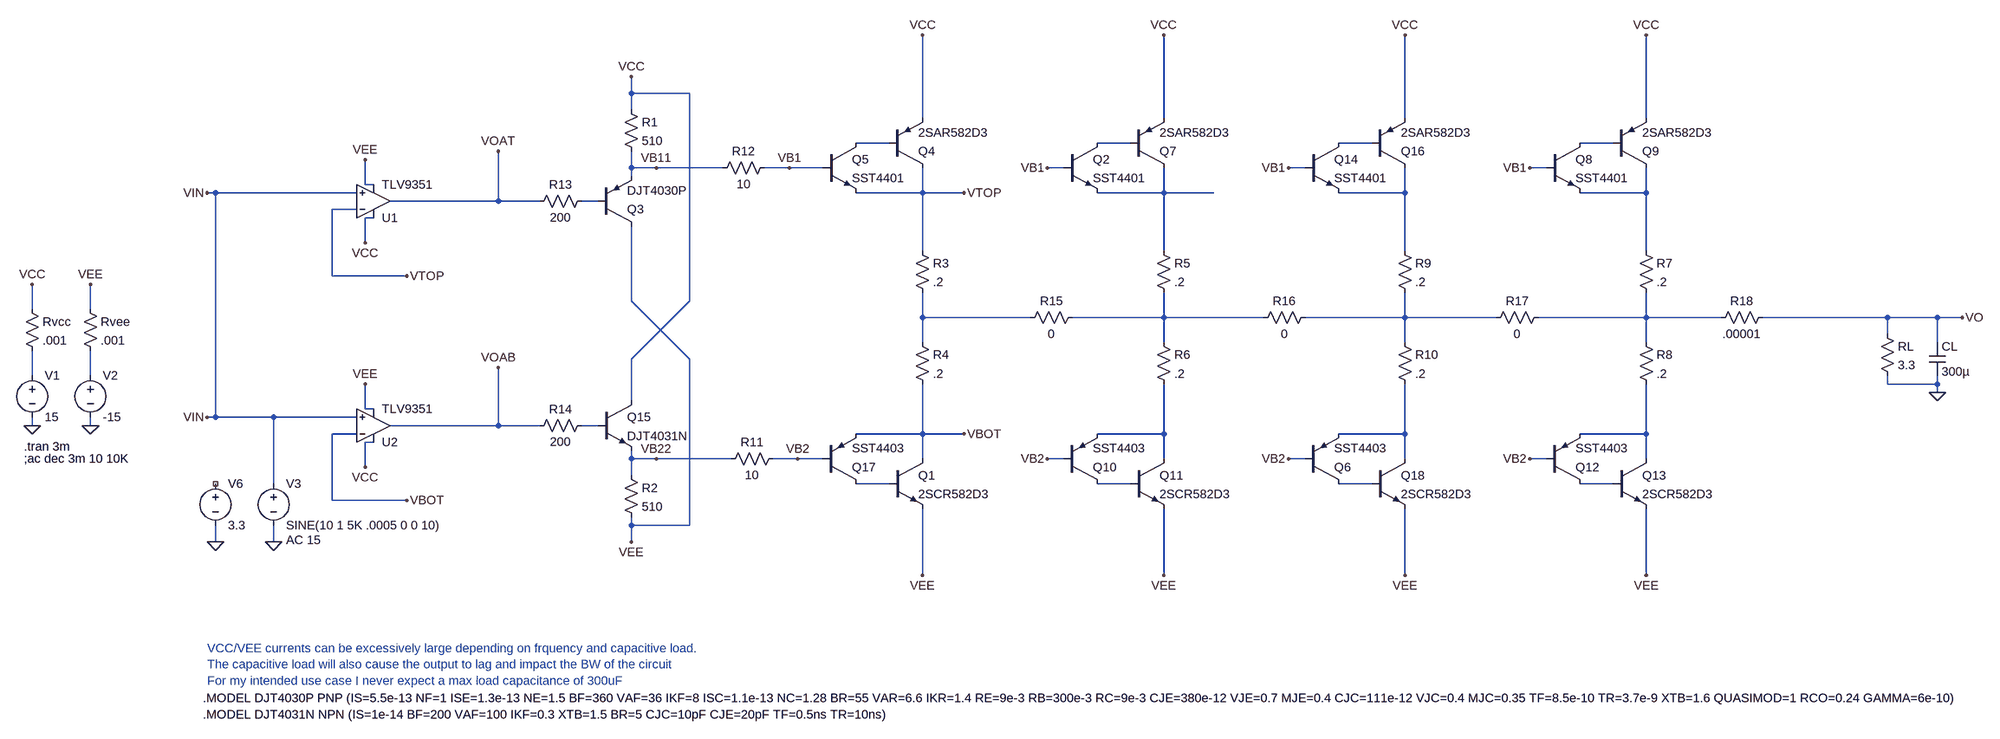
[diagram p0: schematic NOT_USED_Current Amplifier-1_REV_22.asc]
NOT_USED_Current Amplifier-1_REV_22.asc, the LTspice schematic file:
Version 4
SHEET 1 3356 1336
WIRE 80 -128 80 -160
WIRE 192 -128 80 -128
WIRE 80 -96 80 -128
WIRE 640 -80 640 -240
WIRE 1104 -80 1104 -240
WIRE 1568 -80 1568 -240
WIRE 2032 -80 2032 -240
WIRE 576 -32 512 -32
WIRE 1040 -32 976 -32
WIRE 1504 -32 1440 -32
WIRE 1968 -32 1904 -32
WIRE 80 16 80 -16
WIRE 128 16 80 16
WIRE 256 16 128 16
WIRE 384 16 336 16
WIRE 448 16 384 16
WIRE 912 16 880 16
WIRE 1376 16 1344 16
WIRE 1840 16 1808 16
WIRE 80 32 80 16
WIRE -432 48 -432 0
WIRE -416 48 -432 48
WIRE -720 64 -736 64
WIRE -448 64 -720 64
WIRE 640 64 640 16
WIRE 640 64 512 64
WIRE 720 64 640 64
WIRE 1104 64 1104 16
WIRE 1104 64 976 64
WIRE 1200 64 1104 64
WIRE 1568 64 1568 16
WIRE 1568 64 1440 64
WIRE 2032 64 2032 16
WIRE 2032 64 1904 64
WIRE -176 80 -176 -16
WIRE -176 80 -384 80
WIRE -96 80 -176 80
WIRE 16 80 -16 80
WIRE -448 96 -496 96
WIRE -416 112 -432 112
WIRE -432 160 -432 112
WIRE 640 176 640 64
WIRE 1104 176 1104 64
WIRE 1568 176 1568 64
WIRE 2032 176 2032 64
WIRE -496 224 -496 96
WIRE -352 224 -496 224
WIRE 80 272 80 128
WIRE 192 272 192 -128
WIRE -1424 288 -1424 240
WIRE -1312 288 -1312 240
WIRE 640 304 640 256
WIRE 848 304 640 304
WIRE 1104 304 1104 256
WIRE 1104 304 928 304
WIRE 1296 304 1104 304
WIRE 1568 304 1568 256
WIRE 1568 304 1376 304
WIRE 1744 304 1568 304
WIRE 2032 304 2032 256
WIRE 2032 304 1824 304
WIRE 2176 304 2032 304
WIRE 2496 304 2256 304
WIRE 2592 304 2496 304
WIRE 2640 304 2592 304
WIRE 2496 336 2496 304
WIRE 640 352 640 304
WIRE 1104 352 1104 304
WIRE 1568 352 1568 304
WIRE 2032 352 2032 304
WIRE 2592 352 2592 304
WIRE 80 384 192 272
WIRE 192 384 80 272
WIRE -1424 416 -1424 368
WIRE -1312 416 -1312 368
WIRE 2496 432 2496 416
WIRE 2592 432 2592 416
WIRE 2592 432 2496 432
WIRE 2592 448 2592 432
WIRE 80 464 80 384
WIRE -432 480 -432 432
WIRE -416 480 -432 480
WIRE -720 496 -720 64
WIRE -720 496 -736 496
WIRE -608 496 -720 496
WIRE -448 496 -608 496
WIRE -1424 512 -1424 496
WIRE -1312 512 -1312 496
WIRE -176 512 -176 400
WIRE -176 512 -384 512
WIRE -96 512 -176 512
WIRE 16 512 -16 512
WIRE -448 528 -496 528
WIRE 640 528 640 432
WIRE 640 528 512 528
WIRE 720 528 640 528
WIRE 1104 528 1104 432
WIRE 1104 528 976 528
WIRE 1568 528 1568 432
WIRE 1568 528 1440 528
WIRE 2032 528 2032 432
WIRE 2032 528 1904 528
WIRE -416 544 -432 544
WIRE 80 576 80 560
WIRE 128 576 80 576
WIRE 272 576 128 576
WIRE 400 576 352 576
WIRE 448 576 400 576
WIRE 640 576 640 528
WIRE 912 576 880 576
WIRE 1104 576 1104 528
WIRE 1376 576 1344 576
WIRE 1568 576 1568 528
WIRE 1840 576 1808 576
WIRE 2032 576 2032 528
WIRE -432 592 -432 544
WIRE 80 608 80 576
WIRE -608 624 -608 496
WIRE 576 624 512 624
WIRE 1040 624 976 624
WIRE 1504 624 1440 624
WIRE 1968 624 1904 624
WIRE -496 656 -496 528
WIRE -352 656 -496 656
WIRE 80 704 80 688
WIRE 192 704 192 384
WIRE 192 704 80 704
WIRE -720 736 -720 704
WIRE -608 736 -608 704
WIRE 80 736 80 704
WIRE 640 800 640 672
WIRE 1104 800 1104 672
WIRE 1568 800 1568 672
WIRE 2032 800 2032 672
FLAG -1424 240 VCC
FLAG -1312 240 VEE
FLAG -1424 512 0
FLAG -1312 512 0
FLAG 640 -240 VCC
FLAG 640 800 VEE
FLAG -432 160 VCC
FLAG -432 0 VEE
FLAG 2592 448 0
FLAG 2640 304 VO
FLAG -736 64 VIN
FLAG 80 -160 VCC
FLAG 80 736 VEE
FLAG 1104 -240 VCC
FLAG 1104 800 VEE
FLAG 384 16 VB1
FLAG 400 576 VB2
FLAG 880 16 VB1
FLAG 880 576 VB2
FLAG 2032 -240 VCC
FLAG 2032 800 VEE
FLAG 1808 16 VB1
FLAG 1808 576 VB2
FLAG 1568 -240 VCC
FLAG 1568 800 VEE
FLAG 1344 16 VB1
FLAG 1344 576 VB2
FLAG 128 16 VB11
FLAG 128 576 VB22
FLAG 720 64 VTOP
FLAG 720 528 VBOT
FLAG -432 592 VCC
FLAG -432 432 VEE
FLAG -608 736 0
FLAG -736 496 VIN
FLAG -720 736 0
FLAG -352 224 VTOP
FLAG -352 656 VBOT
FLAG -176 -16 VOAT
FLAG -176 400 VOAB
SYMBOL voltage -1424 400 R0
WINDOW 123 0 0 Left 0
WINDOW 39 0 0 Left 0
SYMATTR InstName V1
SYMATTR Value 15
SYMBOL voltage -1312 400 R0
WINDOW 123 0 0 Left 0
WINDOW 39 0 0 Left 0
SYMATTR InstName V2
SYMATTR Value -15
SYMBOL res 624 160 R0
SYMATTR InstName R3
SYMATTR Value .2
SYMBOL res 624 336 R0
SYMATTR InstName R4
SYMATTR Value .2
SYMBOL res 2480 320 R0
SYMATTR InstName RL
SYMATTR Value 3.3
SYMBOL cap 2576 352 R0
SYMATTR InstName CL
SYMATTR Value 300µ
SYMBOL res 64 -112 R0
SYMATTR InstName R1
SYMATTR Value 510
SYMBOL res 64 592 R0
SYMATTR InstName R2
SYMATTR Value 510
SYMBOL res 1088 160 R0
SYMATTR InstName R5
SYMATTR Value .2
SYMBOL res 1088 336 R0
SYMATTR InstName R6
SYMATTR Value .2
SYMBOL res 2016 160 R0
SYMATTR InstName R7
SYMATTR Value .2
SYMBOL res 2016 336 R0
SYMATTR InstName R8
SYMATTR Value .2
SYMBOL npn 448 -32 R0
SYMATTR InstName Q5
SYMATTR Value SST4401
SYMBOL pnp 576 16 M180
SYMATTR InstName Q4
SYMATTR Value 2SAR582D3
SYMBOL npn 576 576 R0
SYMATTR InstName Q1
SYMATTR Value 2SCR582D3
SYMBOL npn 912 -32 R0
SYMATTR InstName Q2
SYMATTR Value SST4401
SYMBOL pnp 1040 16 M180
SYMATTR InstName Q7
SYMATTR Value 2SAR582D3
SYMBOL npn 1840 -32 R0
SYMATTR InstName Q8
SYMATTR Value SST4401
SYMBOL pnp 1968 16 M180
SYMATTR InstName Q9
SYMATTR Value 2SAR582D3
SYMBOL npn 1040 576 R0
SYMATTR InstName Q11
SYMATTR Value 2SCR582D3
SYMBOL pnp 1840 624 M180
SYMATTR InstName Q12
SYMATTR Value SST4403
SYMBOL npn 1968 576 R0
SYMATTR InstName Q13
SYMATTR Value 2SCR582D3
SYMBOL res 1552 160 R0
SYMATTR InstName R9
SYMATTR Value .2
SYMBOL res 1552 336 R0
SYMATTR InstName R10
SYMATTR Value .2
SYMBOL npn 1376 -32 R0
SYMATTR InstName Q14
SYMATTR Value SST4401
SYMBOL pnp 1504 16 M180
SYMATTR InstName Q16
SYMATTR Value 2SAR582D3
SYMBOL npn 1504 576 R0
SYMATTR InstName Q18
SYMATTR Value 2SCR582D3
SYMBOL res 368 560 R90
WINDOW 0 0 56 VBottom 2
WINDOW 3 32 56 VTop 2
SYMATTR InstName R11
SYMATTR Value 10
SYMBOL res 352 0 R90
WINDOW 0 0 56 VBottom 2
WINDOW 3 32 56 VTop 2
SYMATTR InstName R12
SYMATTR Value 10
SYMBOL Hab_OpAmp\\TLV9351 -416 144 M180
SYMATTR InstName U1
SYMBOL res 0 64 R90
WINDOW 0 0 56 VBottom 2
WINDOW 3 32 56 VTop 2
SYMATTR InstName R13
SYMATTR Value 200
SYMBOL res 0 496 R90
WINDOW 0 0 56 VBottom 2
WINDOW 3 32 56 VTop 2
SYMATTR InstName R14
SYMATTR Value 200
SYMBOL npn 16 464 R0
SYMATTR InstName Q15
SYMATTR Value DJT4031N
SYMBOL pnp 16 128 M180
SYMATTR InstName Q3
SYMATTR Value DJT4030P
SYMBOL res -1440 272 R0
SYMATTR InstName Rvcc
SYMATTR Value .001
SYMBOL res -1328 272 R0
SYMATTR InstName Rvee
SYMATTR Value .001
SYMBOL res 944 288 R90
WINDOW 0 0 56 VBottom 2
WINDOW 3 32 56 VTop 2
SYMATTR InstName R15
SYMATTR Value 0
SYMBOL res 1392 288 R90
WINDOW 0 0 56 VBottom 2
WINDOW 3 32 56 VTop 2
SYMATTR InstName R16
SYMATTR Value 0
SYMBOL res 1840 288 R90
WINDOW 0 0 56 VBottom 2
WINDOW 3 32 56 VTop 2
SYMATTR InstName R17
SYMATTR Value 0
SYMBOL res 2272 288 R90
WINDOW 0 0 56 VBottom 2
WINDOW 3 32 56 VTop 2
SYMATTR InstName R18
SYMATTR Value .00001
SYMBOL pnp 1376 624 M180
SYMATTR InstName Q6
SYMATTR Value SST4403
SYMBOL pnp 912 624 M180
SYMATTR InstName Q10
SYMATTR Value SST4403
SYMBOL pnp 448 624 M180
SYMATTR InstName Q17
SYMATTR Value SST4403
SYMBOL voltage -608 608 R0
WINDOW 123 24 124 Left 2
WINDOW 39 0 0 Left 0
SYMATTR Value2 AC 15
SYMATTR InstName V3
SYMATTR Value SINE(10 1 5K .0005 0 0 10)
SYMBOL voltage -720 608 R0
WINDOW 123 0 0 Left 0
WINDOW 39 0 0 Left 0
SYMATTR InstName V6
SYMATTR Value 3.3
SYMBOL Hab_OpAmp\\TLV9351 -416 576 M180
SYMATTR InstName U2
TEXT -1440 552 Left 2 !.tran 3m
TEXT -1440 576 Left 2 !;ac dec 3m 10 10K
TEXT -736 944 Left 2 ;VCC/VEE currents can be excessively large depending on frquency and capacitive load.\nThe capacitive load will also cause the output to lag and impact the BW of the circuit\nFor my intended use case I never expect a max load capacitance of 300uF
TEXT -744 1040 Left 2 !.MODEL DJT4030P PNP (IS=5.5e-13 NF=1 ISE=1.3e-13 NE=1.5 BF=360 VAF=36 IKF=8 ISC=1.1e-13 NC=1.28 BR=55 VAR=6.6 IKR=1.4 RE=9e-3 RB=300e-3 RC=9e-3 CJE=380e-12 VJE=0.7 MJE=0.4 CJC=111e-12 VJC=0.4 MJC=0.35 TF=8.5e-10 TR=3.7e-9 XTB=1.6 QUASIMOD=1 RCO=0.24 GAMMA=6e-10)\n.MODEL DJT4031N NPN (IS=1e-14 BF=200 VAF=100 IKF=0.3 XTB=1.5 BR=5 CJC=10pF CJE=20pF TF=0.5ns TR=10ns)

The netlist it stands for:
* NOT_USED_Current Amplifier-1_REV_22.asc
V1 N013 0 15
V2 N014 0 -15
R3 VTOP N009 .2
R4 N009 VBOT .2
RL VO 0 3.3
CL VO 0 300µ
R1 VCC VB11 510
R2 VB22 VEE 510
R5 N005 N010 .2
R6 N010 N016 .2
R7 N007 N012 .2
R8 N012 N018 .2
Q5 N001 VB1 VTOP 0 SST4401
Q4 VTOP N001 VCC 0 2SAR582D3
Q1 VBOT N019 VEE 0 2SCR582D3
Q2 N002 VB1 N005 0 SST4401
Q7 N005 N002 VCC 0 2SAR582D3
Q8 N004 VB1 N007 0 SST4401
Q9 N007 N004 VCC 0 2SAR582D3
Q11 N016 N020 VEE 0 2SCR582D3
Q12 N022 VB2 N018 0 SST4403
Q13 N018 N022 VEE 0 2SCR582D3
R9 N006 N011 .2
R10 N011 N017 .2
Q14 N003 VB1 N006 0 SST4401
Q16 N006 N003 VCC 0 2SAR582D3
Q18 N017 N021 VEE 0 2SCR582D3
R11 VB2 VB22 10
R12 VB1 VB11 10
* U1: TLV9351 (symbol Hab_OpAmp\TLV9351 not available, pins judged from their places): In+=VIN In-=VTOP V+=VCC V-=VEE OUT=VOAT
R13 N008 VOAT 200
R14 N015 VOAB 200
Q15 VCC N015 VB22 0 DJT4031N
Q3 VEE N008 VB11 0 DJT4030P
Rvcc VCC N013 .001
Rvee VEE N014 .001
R15 N010 N009 0
R16 N011 N010 0
R17 N012 N011 0
R18 VO N012 .00001
Q6 N021 VB2 N017 0 SST4403
Q10 N020 VB2 N016 0 SST4403
Q17 N019 VB2 VBOT 0 SST4403
V3 VIN 0 SINE(10 1 5K .0005 0 0 10) AC 15
V6 NC_01 0 3.3
* U2: TLV9351 (symbol Hab_OpAmp\TLV9351 not available, pins judged from their places): In+=VIN In-=VBOT V+=VCC V-=VEE OUT=VOAB
.model NPN NPN
.model PNP PNP
.lib standard.bjt
.tran 3m
;ac dec 3m 10 10K
* VCC/VEE currents can be excessively large depending on frquency and capacitive load.
* The capacitive load will also cause the output to lag and impact the BW of the circuit
* For my intended use case I never expect a max load capacitance of 300uF
.MODEL DJT4030P PNP (IS=5.5e-13 NF=1 ISE=1.3e-13 NE=1.5 BF=360 VAF=36 IKF=8 ISC=1.1e-13 NC=1.28 BR=55 VAR=6.6 IKR=1.4 RE=9e-3 RB=300e-3 RC=9e-3 CJE=380e-12 VJE=0.7 MJE=0.4 CJC=111e-12 VJC=0.4 MJC=0.35 TF=8.5e-10 TR=3.7e-9 XTB=1.6 QUASIMOD=1 RCO=0.24 GAMMA=6e-10)
.MODEL DJT4031N NPN (IS=1e-14 BF=200 VAF=100 IKF=0.3 XTB=1.5 BR=5 CJC=10pF CJE=20pF TF=0.5ns TR=10ns)
.backanno
.end